# EAGLE design rk1robot_v0_5 (EAGLE 6.5.0)
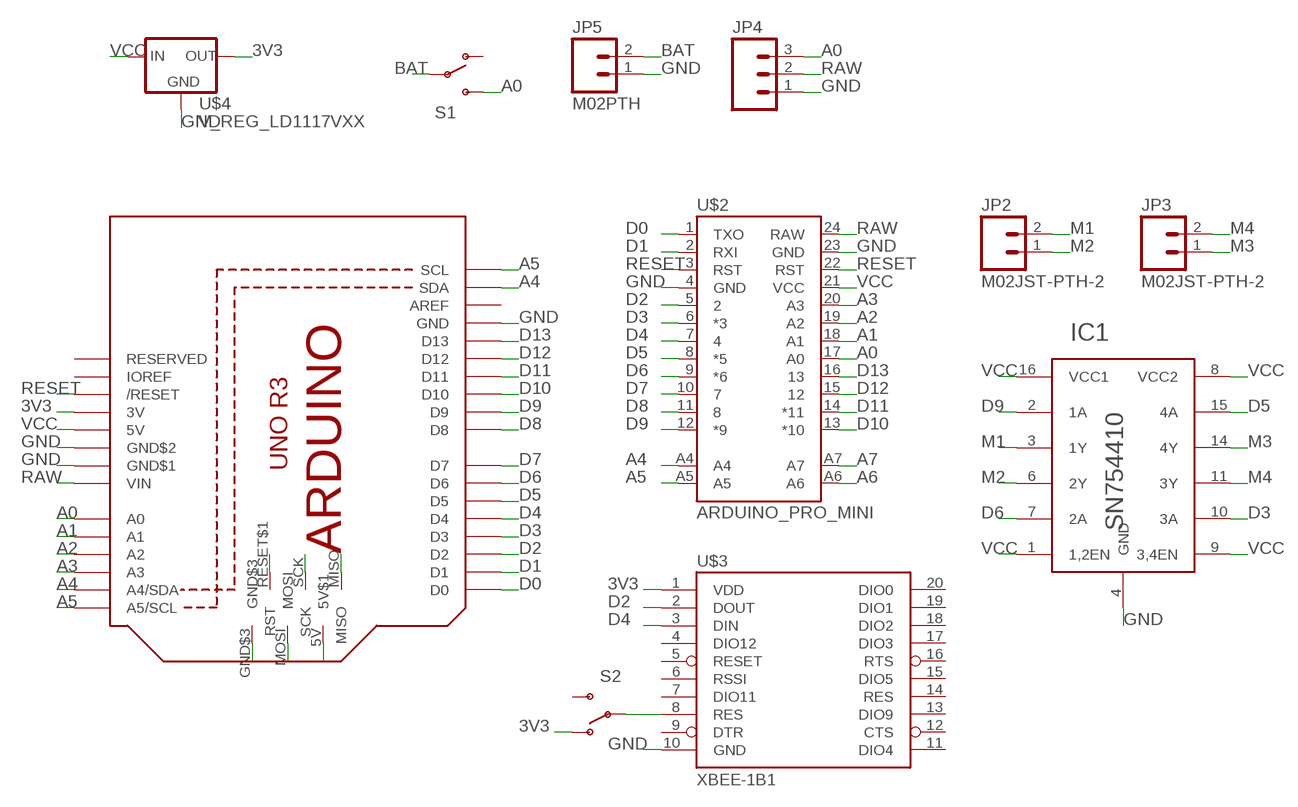
[diagram p0: schematic, sheet 1]

## Parts
IC1  SN754410  [DIL16]
JP2  M02JST-PTH-2  [JST-2-PTH]
JP3  M02JST-PTH-2  [JST-2-PTH]
JP4  M03PTH  [1X03]
JP5  M02PTH  [1X02]
S1  SWITCH-SPDTPTH  [SWITCH-SPDT]
S2  SWITCH-SPDTPTH  [SWITCH-SPDT]
U$1  ARDUINO_R3_ICSP  [ARDUINOR3_ICSP]
U$2  ARDUINO_PRO_MINI  [ARDUINO_PRO_MINI]
U$3  XBEE-1B1  [XBEE-1]
U$4  V_REG_LD1117VXX  [78XXL]

## Nets
3V3: S2.1(O) U$1.3V U$3.1(VDD) U$4.GND(OUT)
A0: JP4.3 S1.3(S) U$1.A0 U$2.17(A0)
A1: U$1.A1 U$2.18(A1)
A2: U$1.A2 U$2.19(A2)
A3: U$1.A3 U$2.20(A3)
A4: U$1.A4(A4/SDA) U$1.SDA U$2.A4
A5: U$1.A5(A5/SCL) U$1.SCL U$2.A5
A6: U$2.A6
A7: U$2.A7
BAT: JP5.2 S1.2(P)
D0: U$1.D0 U$2.1(TXO)
D1: U$1.D1 U$2.2(RXI)
D2: U$1.D2 U$2.5 U$3.2(DOUT)
D3: IC1.10(3A) U$1.D3 U$2.6(*3)
D4: U$1.D4 U$2.7 U$3.3(DIN)
D5: IC1.15(4A) U$1.D5 U$2.8(*5)
D6: IC1.7(2A) U$1.D6 U$2.9(*6)
D7: U$1.D7 U$2.10
D8: U$1.D8 U$2.11
D9: IC1.2(1A) U$1.D9 U$2.12(*9)
D10: U$1.D10 U$2.13(*10)
D11: U$1.D11 U$1.MOSI U$2.14(*11)
D12: U$1.D12 U$1.MISO U$2.15
D13: U$1.D13 U$1.SCK U$2.16
GND: IC1.4(GND) JP4.1 JP5.1 U$1.GND U$1.GND$1 U$1.GND$2 U$1.GND$3 U$2.4(GND) U$2.23(GND) U$3.10(GND) U$4.IN(GND)
M1: IC1.3(1Y) JP2.2
M2: IC1.6(2Y) JP2.1
M3: IC1.14(4Y) JP3.1
M4: IC1.11(3Y) JP3.2
N$5: S2.2(P) U$3.8(RES)
RAW: JP4.2 U$1.VIN U$2.24(RAW)
RESET: U$1.RESET$1(RST) U$1.RESET(/RESET) U$2.3(RST) U$2.22(RST)
VCC: IC1.1(1,2EN) IC1.8(VCC2) IC1.9(3,4EN) IC1.16(VCC1) U$1.5V(5V$1) U$1.+5V(5V) U$2.21(VCC) U$4.OUT(IN)
Unconnected: S1.1(O) S2.3(S) U$1.AREF U$1.IOREF U$1.RESERVED U$3.4(DIO12) U$3.5(RESET) U$3.6(RSSI) U$3.7(DIO11) U$3.9(DTR) U$3.11(DIO4) U$3.12(CTS) U$3.13(DIO9) U$3.14(RES) U$3.15(DIO5) U$3.16(RTS) U$3.17(DIO3) U$3.18(DIO2) U$3.19(DIO1) U$3.20(DIO0)

## Power pins joined to a net without a drawn wire
GND: IC1.5(GND) IC1.12(GND) IC1.13(GND)

## Library data of the parts
IC1 = DualBridge:SN754410: Quad Half-Bridge Driver
JP2 JP3 JP5 = SparkFun-Connectors:M02: Standard 2-pin 0.1" header. Use with - straight break away headers ( PRT-00116) - right angle break away headers (PRT-00553) - swiss pins (PRT-00743) - machine pins (PRT-00117) - female headers (PRT-00115) Molex polarized connector foot print use with: PRT-08233 with associated crimp pins and housings. 2.54_SCREWTERM for use with PRT-10571. 3.5mm Screw Terminal footprints for PRT-08084 5mm Screw Terminal footprints for use with PRT-08433
JP4 = SparkFun-Connectors:M03: Header 3 Standard 3-pin 0.1" header. Use with straight break away headers (SKU : PRT-00116), right angle break away headers (PRT-00553), swiss pins (PRT-00743), machine pins (PRT-00117), and female headers (PRT-00115). Molex polarized connector foot print use with SKU : PRT-08232 with associated crimp pins and housings.
S1 S2 = SparkFun-Electromechanical:SWITCH-SPDT: SPDT Switch Simple slide switch, Spark Fun Electronics SKU : COM-00102 DPDT SMT slide switch, AYZ0202, SWCH-08179
U$1 = adafruit:ARDUINO_R3_ICSP
U$2 = SparkFun-Boards:ARDUINO_PRO_MINI
U$3 = SparkFun-RF:XBEE-1: Xbee module footprints SMT header is CONN-09042.
U$4 = SparkFun-PowerIC:V_REG_LD1117VXX: LD1117VXX voltage regulator. We carry the 3.3V version (COM-00526) in TO-220 package.

## Board
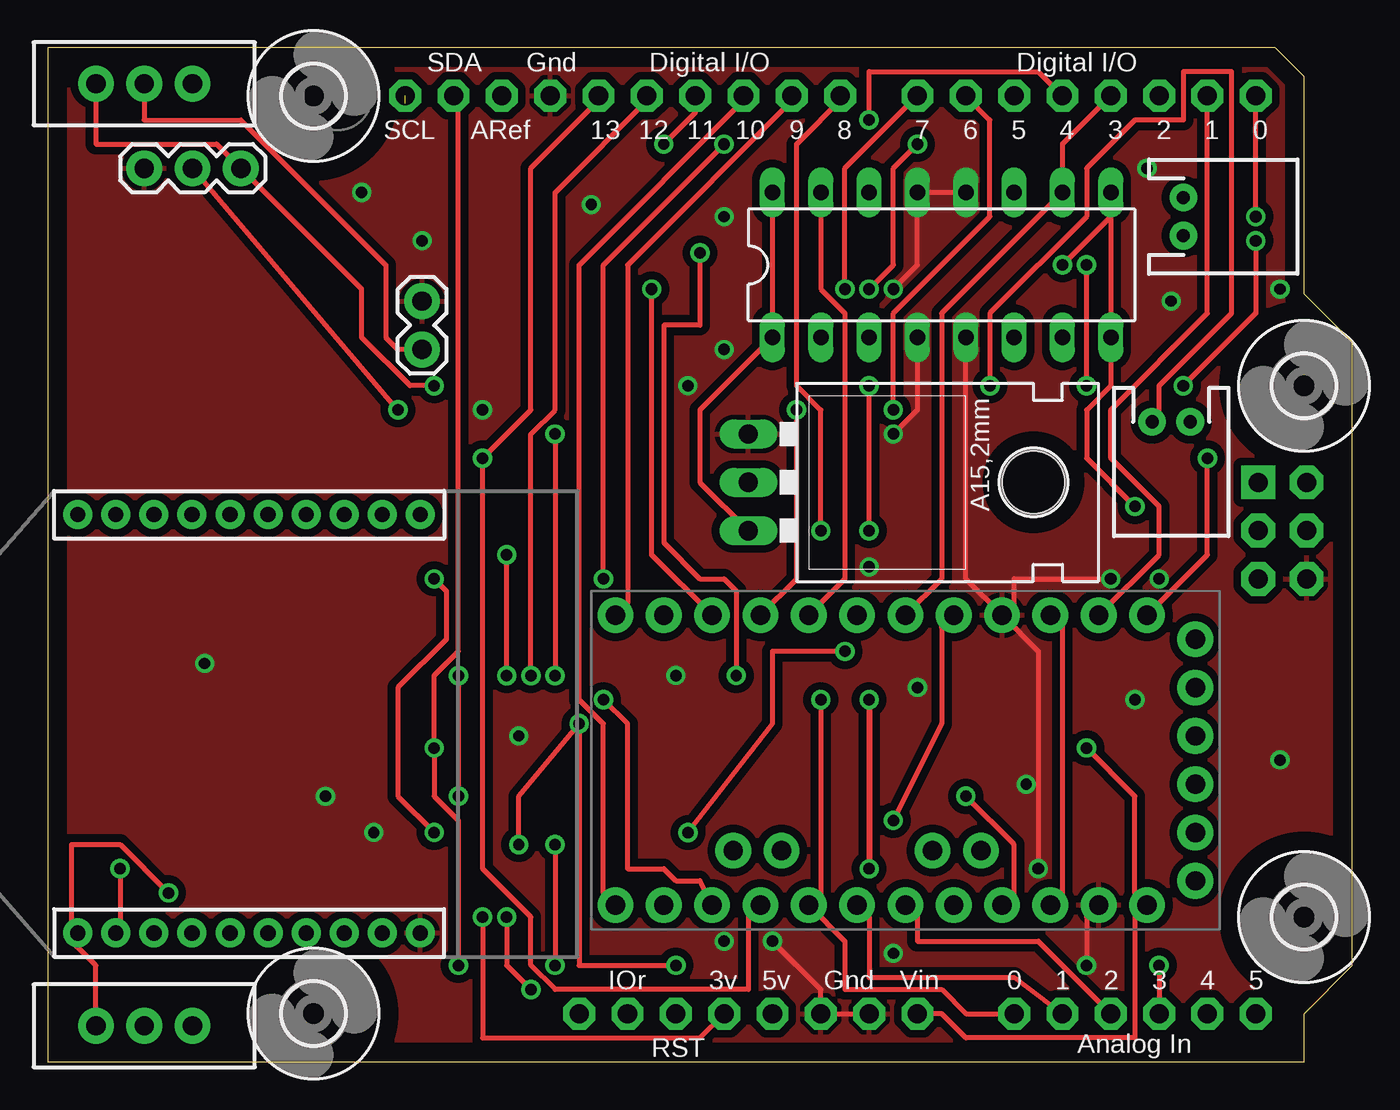
[diagram p1: board, top side]
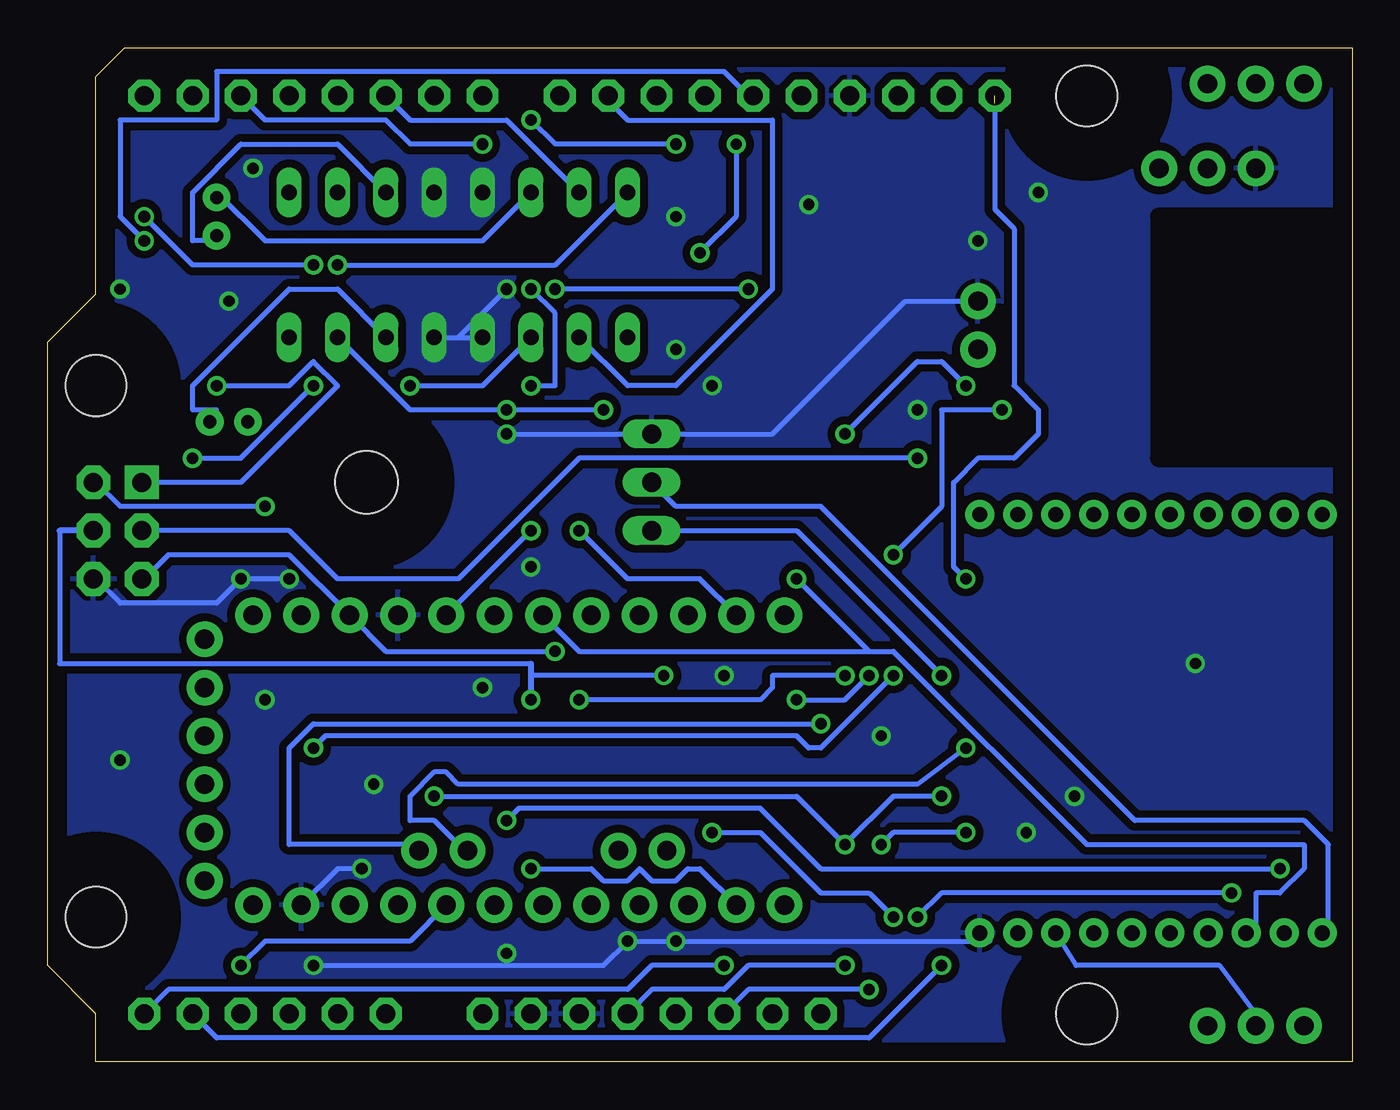
[diagram p2: board, bottom side, seen from below]

Size 68.58 x 53.34 mm. Coordinates in mm from the lower left corner, seen from the top.
Copper layers (1*16): Top 0.035mm / dielectric 1.5mm / Bottom 0.035mm
Design rules "default": minimum track width 10mil, minimum drill 24mil, track to track 8mil, track to pad 8mil, pad to pad 8mil, via to via 8mil, smd to smd 8mil, copper to edge 40mil, drill to drill 8mil, minimum pad ring 10mil, minimum via ring 8mil, stop-mask expansion 4mil, vias tented up to drill 0mil, thermal gap 10mil

### Footprints (pad centres in the part's own frame; a part is rotated, then mirrored left to right if it is on the bottom)
DIL16 = drill 0.813 long: 1 -8.89,-3.81; 2 -6.35,-3.81; 3 -3.81,-3.81; 4 -1.27,-3.81; 5 1.27,-3.81; 6 3.81,-3.81; 7 6.35,-3.81; 8 8.89,-3.81; 9 8.89,3.81; 10 6.35,3.81; 11 3.81,3.81; 12 1.27,3.81; 13 -1.27,3.81; 14 -3.81,3.81; 15 -6.35,3.81; 16 -8.89,3.81
JST-2-PTH = drill 0.7 pad 1.448: 1 -1,0; 2 1,0
1X03 = drill 1.016 pad 1.88: 1 0,0; 2 2.54,0; 3 5.08,0
1X02 = drill 1.016 pad 1.88: 1 0,0; 2 2.54,0
SWITCH-SPDT = drill 1.016 pad 1.88: 1 0,2.54; 2 0,0; 3 0,-2.54
ARDUINOR3_ICSP = drill 1 pad 1.676 octagon: 3V 35.56,2.54; 5V 38.1,2.54; A0 50.8,2.54; A1 53.34,2.54; A2 55.88,2.54; A3 58.42,2.54; A4 60.96,2.54; A5 63.5,2.54; AREF 23.876,50.8; D0 63.5,50.8; D1 60.96,50.8; D2 58.42,50.8; D3 55.88,50.8; D4 53.34,50.8; D5 50.8,50.8; D6 48.26,50.8; D7 45.72,50.8; D8 41.656,50.8; D9 39.116,50.8; D10 36.576,50.8; D11 34.036,50.8; D12 31.496,50.8; D13 28.956,50.8; GND 26.416,50.8; GND$2 43.18,2.54; GND$3 40.64,2.54; IOREF 30.48,2.54; RESERVED 27.94,2.54; RESET 33.02,2.54; SCL 18.796,50.8; SDA 21.336,50.8; VIN 45.72,2.54 | drill 1 pad 1.778 octagon: +5V 66.167,30.48; GND$1 66.167,25.4; MOSI 66.167,27.94; RESET$1 63.627,25.4; SCK 63.627,27.94 | drill 1 pad 1.778 square: MISO 63.627,30.48
ARDUINO_PRO_MINI = drill 1.016 pad 1.88: 1 -7.62,12.7; 2 -7.62,10.16; 3 -7.62,7.62; 4 -7.62,5.08; 5 -7.62,2.54; 6 -7.62,0; 7 -7.62,-2.54; 8 -7.62,-5.08; 9 -7.62,-7.62; 10 -7.62,-10.16; 11 -7.62,-12.7; 12 -7.62,-15.24; 13 7.62,-15.24; 14 7.62,-12.7; 15 7.62,-10.16; 16 7.62,-7.62; 17 7.62,-5.08; 18 7.62,-2.54; 19 7.62,0; 20 7.62,2.54; 21 7.62,5.08; 22 7.62,7.62; 23 7.62,10.16; 24 7.62,12.7; A4 4.763,1.429; A5 4.763,3.969; A6 4.763,-9.049; A7 4.763,-6.509; BLK -6.35,15.24; GND -3.81,15.24; GRN 6.35,15.24; RXI 1.27,15.24; TXO 3.81,15.24; VCC -1.27,15.24
XBEE-1 = drill 0.8 pad 1.524: 1 -11,20; 2 -11,18; 3 -11,16; 4 -11,14; 5 -11,12; 6 -11,10; 7 -11,8; 8 -11,6; 9 -11,4; 10 -11,2; 11 11,2; 12 11,4; 13 11,6; 14 11,8; 15 11,10; 16 11,12; 17 11,14; 18 11,16; 19 11,18; 20 11,20
78XXL = drill 1.016 long: GND 0,-3.81; IN -2.54,-3.81; OUT 2.54,-3.81 | hole 3.302: 0,11.176
3,2 = hole 3.2: 0,0

### Placement (x,y rotation side)
IC1  46.99,41.91 0 top
JP2  59.05,33.66 180 top
JP3  59.69,44.45 270 top
JP4  5.08,46.99 0 top
JP5  19.68,40.01 270 top
S1  5.08,51.44 270 top
S2  5.08,1.91 90 top
U$1  0,0 0 top
U$2  45.09,15.88 270 top
U$3  21.59,17.78 90 top
U$4  40.64,30.48 270 top
U$5  [3,2]  13.97,2.54 0 top
U$6  [3,2]  13.97,50.8 0 top
U$7  [3,2]  66.04,7.62 0 top
U$8  [3,2]  66.04,35.56 0 top

### Tracks (layer width: path | path; a pad name or v marks a point on that pad's centre or on a via)
3V3  (via drill 0.61)
  Top 0.254: 1.27,6.35 2.54,5.08 S2.1 | U$1.3V 34.29,1.27 22.86,1.27 v22.86,7.62 | v6.35,8.89 3.81,11.43 1.27,11.43 1.27,6.35 | 1.27,6.35 U$3.1
  Bottom 0.254: U$4.GND 35.56,29.21 27.94,29.21 11.43,12.7 2.54,12.7 1.27,11.43 1.27,6.35 U$3.1 | v22.86,7.62 21.59,8.89 v6.35,8.89
A0  (via drill 0.61)
  Top 0.254: U$1.A0 48.26,2.54 46.99,3.81 41.91,3.81 41.91,6.35 U$2.17 40.64,8.89 v40.64,19.05 | v26.67,33.02 v26.67,20.32 | S1.3 2.54,48.26 8.89,48.26 JP4.3 16.51,40.64 16.51,38.1 19.05,35.56 v20.32,35.56
  Bottom 0.254: v26.67,20.32 30.48,20.32 30.48,19.68 31.11,19.05 v40.64,19.05 | v20.32,35.56 21.59,36.83 22.86,36.83 v26.67,33.02
A1
  Top 0.254: U$1.A1 50.8,4.45 43.18,4.45 43.18,7.62 U$2.18
A2
  Top 0.254: U$1.A2 52.07,6.35 45.72,6.35 45.72,7.62 U$2.19
A3  (via drill 0.61)
  Top 0.254: v58.42,5.08 U$1.A3
  Bottom 0.254: v58.42,5.08 57.15,6.35 49.53,6.35 U$2.20
A4  (via drill 0.61)
  Top 0.254: v21.59,5.08 21.59,12.7 20.32,13.97 v20.32,16.51 20.32,20.32 21.59,21.59 21.59,50.8 U$1.SDA
  Bottom 0.254: v20.32,16.51 22.86,14.61 46.99,14.61 47.62,15.24 48.26,15.24 49.53,13.97 49.53,12.7 48.26,12.7 46.99,11.43 U$2.A4 | U$1.A4 59.69,1.27 25.4,1.27 v21.59,5.08
A5  (via drill 0.6, 0.61)  (1 unrouted)
  Top 0.254: v33.02,5.08 27.94,5.08 v27.94,17.78 24.77,13.97 v24.77,11.43 | v20.32,12.06 18.41,13.97 18.41,19.68 20.95,22.23 20.95,24.77 v20.32,25.4
  Bottom 0.254: U$1.A5 62.23,3.81 38.1,3.81 36.83,5.08 v33.02,5.08 | v27.94,17.78 54.61,17.78 55.88,16.51 55.88,11.43 49.53,11.43 U$2.A5 | v20.32,12.06 24.13,12.06 v24.77,11.43 | 18.8,50.42 18.8,44.83 17.78,43.81 17.78,35.56 16.51,34.29 16.51,33.02 17.78,31.75 19.68,31.75 20.95,30.48 20.95,26.04 v20.32,25.4
BAT
  Top 0.254: S1.2 5.08,49.53 10.16,49.53 17.78,41.91 17.78,38.1 18.41,37.47 JP5.2
D0  (via drill 0.61)
  Top 0.254: v63.5,44.45 U$1.D0 | v54.61,35.56 v54.61,41.91 | v60.96,31.75 60.96,26.67 U$2.1
  Bottom 0.254: v63.5,44.45 60.96,41.91 v54.61,41.91 | v54.61,35.56 58.42,31.75 v60.96,31.75
D1
  Top 0.254: U$1.D1 60.96,39.37 55.88,34.29 55.88,31.75 58.42,29.21 58.42,26.67 U$2.2
D2  (via drill 0.61)
  Top 0.254: v3.81,10.16 3.81,6.35 U$3.2 | v44.45,12.7 46.99,17.78 46.99,22.86 U$2.5 | v45.72,48.26 44.45,46.99 44.45,41.91 v43.18,40.64 | v43.18,27.94 v43.18,35.56
  Bottom 0.254: v3.81,10.16 27.94,10.16 31.11,13.34 43.81,13.34 v44.45,12.7 | U$1.D2 57.15,49.53 50.8,49.53 49.53,48.26 v45.72,48.26 | v43.18,40.64 41.91,39.37 41.91,35.56 v43.18,35.56 | U$2.5 v43.18,27.94
D3
  Top 0.254: U$1.D3 53.34,48.26 IC1.10 46.99,39.37 46.99,25.4 U$2.6
D4  (via drill 0.61)
  Top 0.254: U$1.D4 52.07,52.07 43.18,52.07 v43.18,49.53 | v35.56,48.26 29.21,41.91 v29.21,25.4
  Bottom 0.254: 25.4,21.59 40.64,21.59 U$2.7 | 25.4,21.59 24.13,21.59 13.97,11.43 2.54,11.43 2.54,10.16 3.81,8.89 5.08,8.89 5.08,6.35 U$3.3 | v43.18,49.53 41.91,48.26 v35.56,48.26 | 25.4,21.59 v29.21,25.4
D5
  Top 0.254: U$2.8 41.91,25.4 41.91,39.37 40.64,40.64 IC1.15
  Bottom 0.254: IC1.15 44.45,49.53 49.53,49.53 U$1.D5
D6  (via drill 0.61)
  Top 0.254: v39.37,34.29 39.37,25.4 U$2.9 | U$1.D6 49.53,49.53 49.53,44.45 44.45,39.37 v44.45,34.29
  Bottom 0.254: IC1.7 49.53,34.29 v44.45,34.29 v39.37,34.29
D7  (via drill 0.61)
  Top 0.254: U$1.D7 41.91,46.99 v41.91,40.64 | v31.75,40.64 31.75,26.67 U$2.10
  Bottom 0.254: v31.75,40.64 v41.91,40.64
D8  (via drill 0.61)
  Top 0.254: v40.64,27.94 40.64,34.29 39.37,35.56 39.37,48.26 41.91,50.8 U$1.D8
  Bottom 0.254: v40.64,27.94 38.1,25.4 34.29,25.4 U$2.11
D9
  Top 0.254: U$2.12 30.48,24.13 30.48,41.91 39.37,50.8 U$1.D9
  Bottom 0.254: IC1.2 38.1,35.56 35.56,35.56 30.48,40.64 30.48,49.53 38.1,49.53 39.37,50.8 U$1.D9
D10
  Top 0.254: U$1.D10 36.83,50.8 27.94,41.91 27.94,19.05 29.21,17.78 29.21,8.89 U$2.13
D11  (via drill 0.6)
  Top 0.254: U$1.D11 34.04,49.91 v32.38,48.26 | v34.29,42.55 34.29,38.73 32.38,38.73 32.38,27.3 34.29,25.4 35.56,25.4 36.2,24.77 v36.2,20.32
  Top 0.305: v43.18,19.05 v43.18,10.16
  Bottom 0.254: 67.94,27.94 67.94,20.95 43.18,20.95 | v43.18,10.16 40.01,10.16 39.37,9.53 38.1,9.53 37.47,10.16 36.83,9.53 35.56,9.53 34.92,10.16 34.29,10.16 U$2.14 | v32.38,48.26 32.38,44.45 v34.29,42.55 | v36.2,20.32 43.18,20.32
  Bottom 0.305: U$1.MOSI 67.94,27.94 | 43.18,20.95 43.18,20.32 v43.18,19.05
D12  (via drill 0.61)
  Top 0.254: v25.4,20.32 25.4,33.02 26.67,34.29 26.67,45.72 31.75,50.8 U$1.D12 | v29.21,19.05 30.48,17.78 30.48,10.16 32.38,10.16 33.02,9.53 34.29,9.53 U$2.15 | v59.69,35.56 63.5,39.37 v63.5,43.18
  Bottom 0.254: v25.4,20.32 26.67,19.05 v29.21,19.05 | U$1.MISO 58.42,30.48 53.34,35.56 54.61,36.83 55.88,35.56 v59.69,35.56 | v63.5,43.18 64.77,44.45 64.77,49.53 59.69,49.53 59.69,52.07 33.02,52.07 31.75,50.8 U$1.D12
D13  (via drill 0.61)
  Top 0.254: U$1.D13 29.21,50.8 25.4,46.99 25.4,34.29 v22.86,31.75 22.86,10.16 25.4,7.62 25.4,5.08 26.67,3.81 36.83,3.81 36.83,7.62 U$2.16
  Bottom 0.254: U$1.SCK 55.88,27.94 53.34,25.4 46.99,25.4 40.64,31.75 v22.86,31.75
GND  (via drill 0.6, 0.61)
  Top 0.254: v38.1,6.35 40.64,3.81 U$1.GND$3 U$1.GND$2 | IC1.12 IC1.13 45.72,41.91 v44.45,40.64 | IC1.5 48.26,25.4 U$2.4 | v55.88,25.4 50.8,25.4 50.8,24.13 U$2.4 | v52.07,10.16 52.07,21.59 U$2.4 | v54.61,5.08 54.61,7.62 U$2.23 | v44.45,33.02 45.72,34.29 IC1.4
  Bottom 0.254: U$3.10 19.05,6.35 v35.56,6.35 v38.1,6.35 39.37,5.08 v54.61,5.08 | IC1.5 46.99,38.1 | 46.99,38.1 IC1.4 | 46.99,38.1 v44.45,40.64 | v55.88,25.4 v58.42,25.4 59.69,24.13 64.77,24.13 66.04,25.4 U$1.GND$1 | U$2.23 53.34,10.16 v52.07,10.16 | v44.45,33.02 U$4.IN 30.48,33.02 23.5,40.01 JP5.1
  other vias: 8.26,20.95 14.61,13.97 17.14,12.06 28.57,45.09 64.77,15.88 45.72,19.68 33.02,20.32 33.66,35.56 35.56,37.47 35.56,44.45 57.15,19.05 51.44,14.61 24.77,17.14 57.78,46.99 59.05,40.01 44.45,5.71 64.77,40.64 43.18,26.04 22.86,34.29 16.51,45.72 19.68,43.18
  pour Top (isolate 0.406): -0.64,53.98 -0.64,-0.64 69.22,-0.64 69.22,53.98
  pour Bottom (isolate 0.406): -1.27,54.61 -1.27,-1.27 69.85,-1.27 69.85,54.61
M1  (via drill 0.61)
  Top 0.254: v49.53,35.56 49.53,39.37 54.61,44.45 54.61,46.99 57.15,49.53 59.69,49.53 59.69,52.07 62.23,52.07 62.23,39.37 58.42,35.56 58.42,34.29 JP2.2
  Bottom 0.254: IC1.3 45.72,35.56 v49.53,35.56
M2
  Bottom 0.254: IC1.6 53.34,40.64 55.88,40.64 60.96,35.56 60.96,34.29 59.69,34.29 JP2.1
M3
  Bottom 0.254: IC1.14 45.72,43.18 57.15,43.18 59.69,45.72 JP3.1
M4
  Bottom 0.254: IC1.11 53.34,48.26 58.42,48.26 60.96,45.72 60.96,43.18 59.69,43.18 JP3.2
N$5
  Bottom 0.254: S2.2 5.08,2.54 6.99,5.08 14.53,5.08 U$3.8
RAW  (via drill 0.61)
  Top 0.254: U$1.VIN 46.99,2.54 48.26,1.27 57.15,1.27 57.15,7.62 U$2.24 57.15,8.89 57.15,13.97 v54.61,16.51 | v18.41,34.29 JP4.2 | v24.13,20.32 v24.13,26.67
  Bottom 0.254: v24.13,20.32 27.94,16.51 28.57,16.51 29.21,17.14 53.98,17.14 v54.61,16.51 | v18.41,34.29 21.59,34.29 21.59,29.21 v24.13,26.67
RESET  (via drill 0.61)
  Top 0.254: v25.4,3.81 24.13,5.08 v24.13,7.62 | v33.66,12.06 38.1,17.78 38.1,21.59 v41.91,21.59 | U$2.22 53.34,8.89 53.34,22.86 U$2.3
  Bottom 0.254: U$1.RESET 31.75,3.81 v25.4,3.81 | v24.13,7.62 25.4,8.89 27.94,8.89 31.11,12.06 v33.66,12.06 | v41.91,21.59 50.8,21.59 U$2.3 55.88,26.67 62.23,26.67 63.5,25.4 U$1.RESET$1
VCC  (via drill 0.61)
  Top 0.254: v26.67,11.43 v26.67,5.08 | v48.26,13.97 50.8,11.43 50.8,8.89 U$2.21 | IC1.16 IC1.1 34.29,34.29 34.29,30.48 U$4.OUT | 55.88,44.45 IC1.8 55.88,35.56 54.61,34.29 54.61,31.75 v57.15,29.21 | 55.88,44.45 v53.34,41.91 | 55.88,44.45 IC1.9 | v21.59,20.32 v21.59,13.97
  Bottom 0.254: U$1.5V 36.83,3.81 33.02,3.81 31.75,5.08 v26.67,5.08 | v48.26,13.97 29.21,13.97 v26.67,11.43 24.13,13.97 v21.59,13.97 | v57.15,29.21 64.77,29.21 66.04,30.48 U$1.+5V | IC1.16 41.91,41.91 v53.34,41.91 | v21.59,20.32 29.21,27.94 U$4.OUT